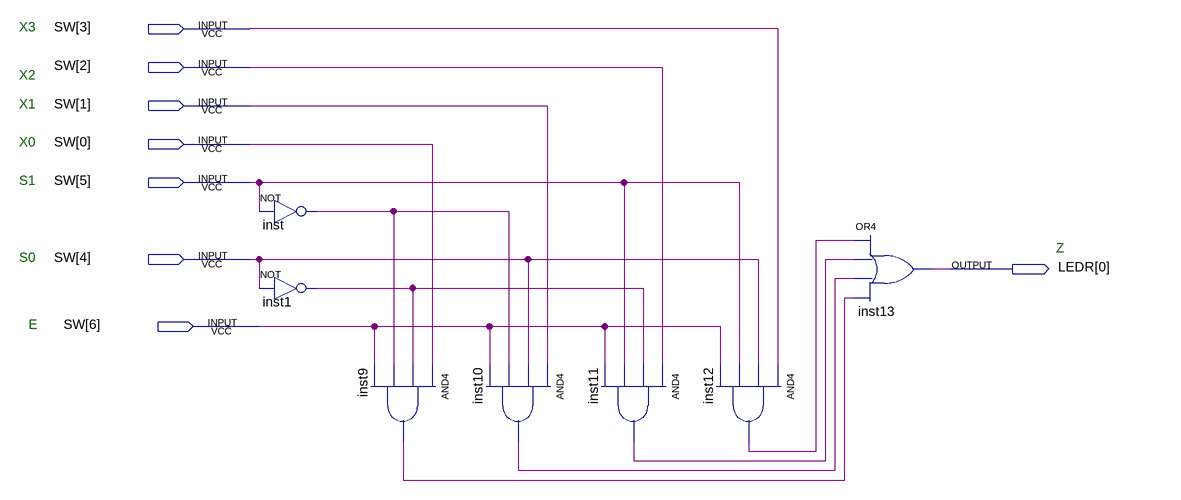
[diagram p0: schematic sheet]
// Quartus schematic projeto2.bdf as structural Verilog: 7 symbols, 8 pins
module projeto2 (
  input  [6:0] SW,
  output [0:0] LEDR
);

  wire inst1_out, inst9_out, inst10_out, inst11_out, inst12_out, inst_out;

  not inst (inst_out, SW[5]);
  not inst1 (inst1_out, SW[4]);
  and inst9 (inst9_out, SW[0], inst1_out, inst_out, SW[6]);
  and inst10 (inst10_out, SW[1], SW[4], inst_out, SW[6]);
  and inst11 (inst11_out, SW[2], inst1_out, SW[5], SW[6]);
  and inst12 (inst12_out, SW[3], SW[4], SW[5], SW[6]);
  or inst13 (LEDR[0], inst12_out, inst11_out, inst10_out, inst9_out);

  // Notes on the sheet:
  //   X3
  //   X2
  //   X1
  //   X0
  //   S1
  //   Z
  //   S0
  //   E
endmodule
